# EAGLE design Corsa LCD (EAGLE 9.5.1)
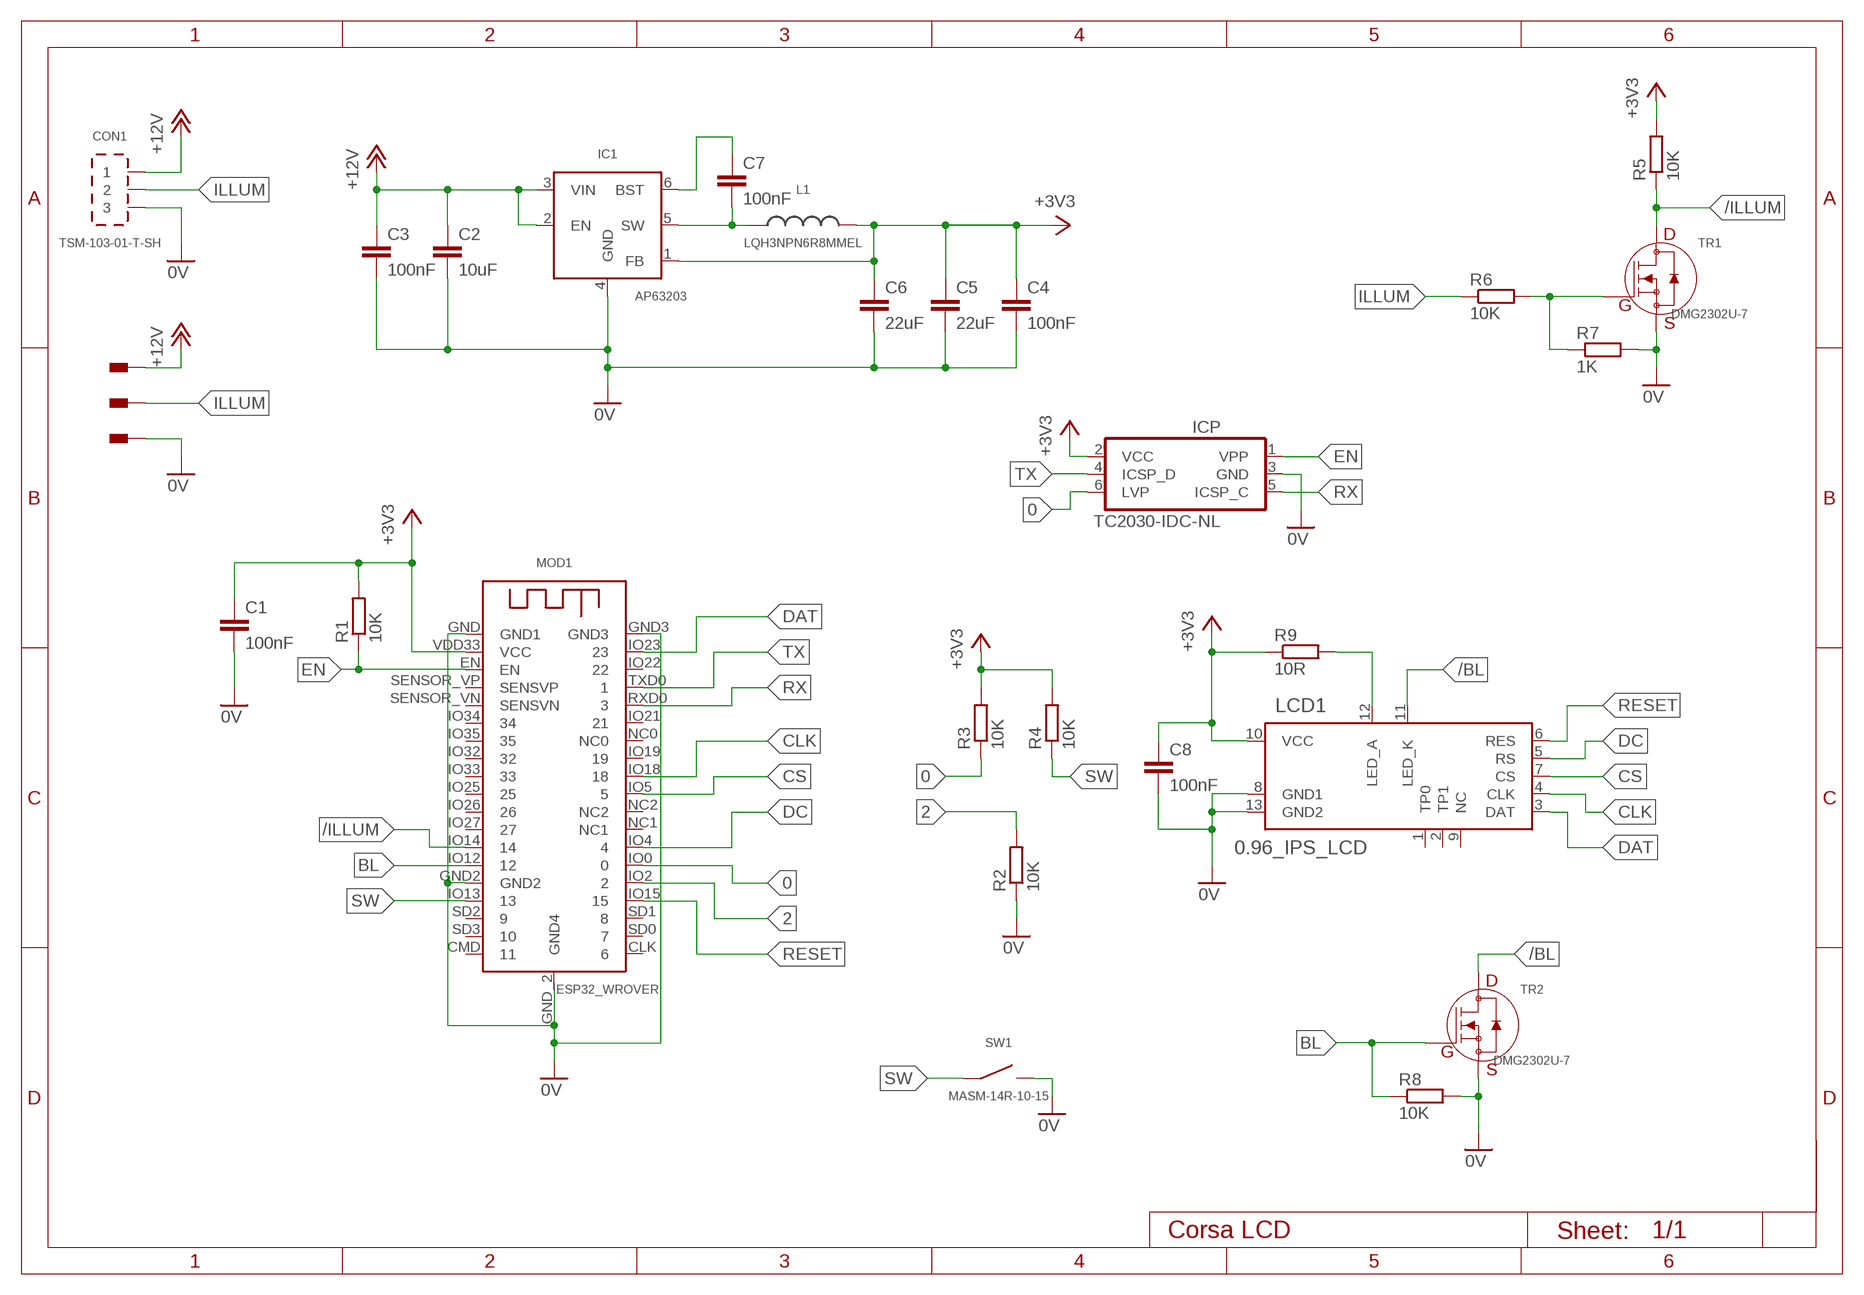
[diagram p0: schematic, sheet 1]

## Parts
C1  100nF  C-EUC0603  [C0603]
C2  10uF  C-EUC0603  [C0603]
C3  100nF  C-EUC0603  [C0603]
C4  100nF  C-EUC0603  [C0603]
C5  22uF  C-EUC0603  [C0603]
C6  22uF  C-EUC0603  [C0603]
C7  100nF  C-EUC0603  [C0603]
C8  100nF  C-EUC0603  [C0603]
CON1  TSM-103-01-T-SH  [TSM-103-01-T-SH]
IC1  AP63203  [TSOT26]
ICP  TC2030-IDC-NL  [TC2030-IDC-NL]
L1  LQH3NPN6R8MMEL  [LQH3NPN]
LCD1  0.96_IPS_LCD  [0.96_IPS_LCD]
MOD1  ESP32_WROVER  ESP32_WROOVER  [ESP32_WROOVER]
PIN1  SOLDERPAD  [SOLDERPAD]
PIN2  SOLDERPAD  [SOLDERPAD]
PIN3  SOLDERPAD  [SOLDERPAD]
R1  10K  R-EU_R0603  [R0603]
R2  10K  R-EU_R0603  [R0603]
R3  10K  R-EU_R0603  [R0603]
R4  10K  R-EU_R0603  [R0603]
R5  10K  R-EU_R0603  [R0603]
R6  10K  R-EU_R0603  [R0603]
R7  1K  R-EU_R0603  [R0603]
R8  10K  R-EU_R0603  [R0603]
R9  10R  R-EU_R0603  [R0603]
SW1  MASM-14R-10-15  [MASM-14]
TR1  DMG2302U-7  [SOT23]
TR2  DMG2302U-7  [SOT23]

## Nets
0: ICP.6(LVP) MOD1.IO0 R3.1
0V: C1.2 C2.2 C3.2 C4.2 C5.2 C6.2 C8.2 CON1.3 IC1.4(GND) ICP.3(GND) LCD1.8(GND1) LCD1.13(GND2) MOD1.GND2 MOD1.GND3 MOD1.GND(GND1) MOD1.GND_2(GND4) PIN3.1 R2.1 R7.2 R8.2 SW1.2 TR1.2(S) TR2.2(S)
2: MOD1.IO2 R2.2
+3V3: C1.1 C4.1 C5.1 C6.1 C8.1 IC1.1(FB) ICP.2(VCC) L1.2 LCD1.10(VCC) MOD1.VDD33(VCC) R1.2 R3.2 R4.2 R5.2 R9.1
+12V: C2.1 C3.1 CON1.1 IC1.2(EN) IC1.3(VIN) PIN1.1
/BL: LCD1.11(LED_K) TR2.3(D)
/ILLUM: MOD1.IO14 R5.1 TR1.3(D)
BL: MOD1.IO12 R8.1 TR2.1(G)
CLK: LCD1.4(CLK) MOD1.IO18
CS: LCD1.7(CS) MOD1.IO5
DAT: LCD1.3(DAT) MOD1.IO23
DC: LCD1.5(RS) MOD1.IO4
EN: ICP.1(VPP) MOD1.EN R1.1
ILLUM: CON1.2 PIN2.1 R6.1
N$1: LCD1.12(LED_A) R9.2
N$2: R6.2 R7.1 TR1.1(G)
N$3: C7.1 IC1.6(BST)
N$5: C7.2 IC1.5(SW) L1.1
RESET: LCD1.6(RES) MOD1.IO15
RX: ICP.5(ICSP_C) MOD1.RXD0
SW: MOD1.IO13 R4.1 SW1.1
TX: ICP.4(ICSP_D) MOD1.TXD0
Unconnected: LCD1.1(TP0) LCD1.2(TP1) LCD1.9(NC) MOD1.CLK MOD1.CMD MOD1.IO19 MOD1.IO21 MOD1.IO22 MOD1.IO25 MOD1.IO26 MOD1.IO27 MOD1.IO32 MOD1.IO33 MOD1.IO34 MOD1.IO35 MOD1.NC0 MOD1.NC1 MOD1.NC2 MOD1.SD0 MOD1.SD1 MOD1.SD2 MOD1.SD3 MOD1.SENSOR_VN(SENSVN) MOD1.SENSOR_VP(SENSVP)

## Library data of the parts
C1-C8 = resistor:C-EU: CAPACITOR, European symbol
CON1 = 0.96_LCD:TSM-103-01-T-SH
IC1 = 0.96_LCD:AP63203
ICP = TagConnect:TC2030-IDC: Tag-Connect In Circuit Programming & Debug Cable 6 Pin http://www.tag-connect.com
L1 = 0.96_LCD:LQH3NPN6R8MMEL
LCD1 = 0.96_LCD:0.96_IPS_LCD
MOD1 = 0.96_LCD:ESP32_WROOVER
PIN1-PIN3 = 0.96_LCD:SOLDERPAD
R1-R9 = resistor:R-EU_: RESISTOR, European symbol
SW1 = 0.96_LCD:MASM-14R-10-15
TR1 TR2 = Carls2:DMG2302U-7

## Board
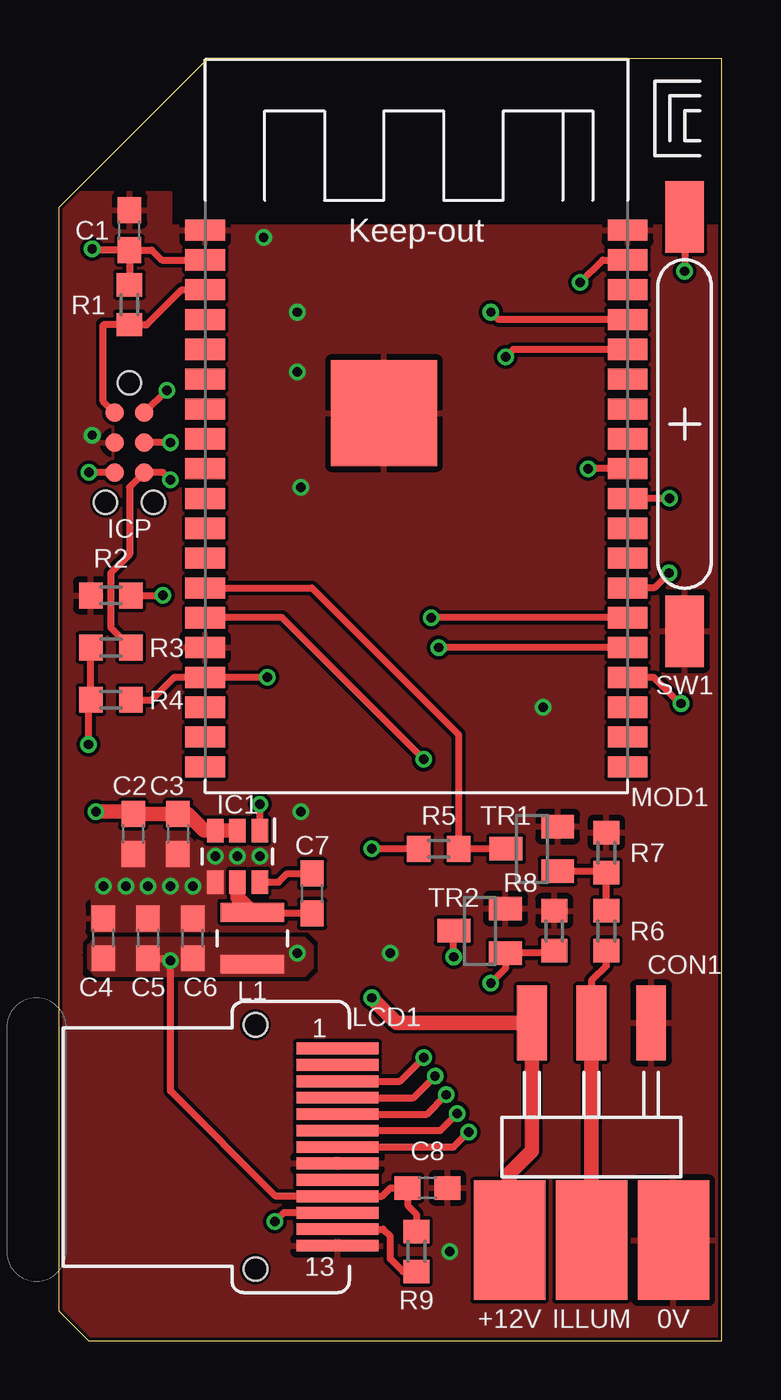
[diagram p1: board, top side]
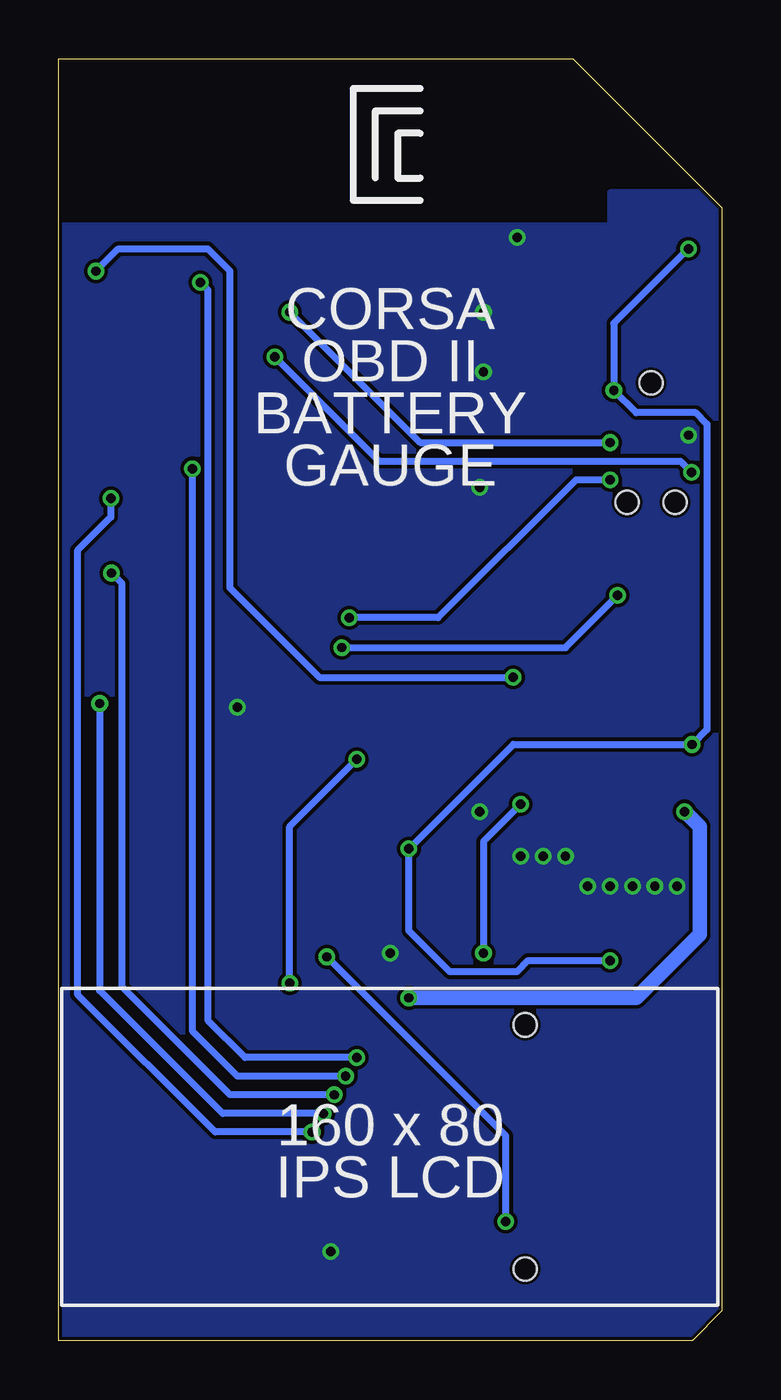
[diagram p2: board, bottom side, seen from below]

Size 28.26 x 54.61 mm. Coordinates in mm from the lower left corner, seen from the top.
Outline: 0,48.26 0,1.27 1.27,0 28.26,0 28.26,54.61 6.35,54.61 0,48.26
Copper layers (1*16): Top 0.035mm / dielectric 1.5mm / Bottom 0.035mm
Design rules "OSH_Default *": minimum track width 6mil, minimum drill 0.3mm, track to track 6mil, track to pad 6mil, pad to pad 6mil, via to via 6mil, smd to smd 6mil, copper to edge 6mil, drill to drill 6mil, minimum pad ring 6mil, minimum via ring 6mil, stop-mask expansion 4mil, vias tented up to drill 0.4mm, thermal gap 10mil

### Footprints (pad centres in the part's own frame; a part is rotated, then mirrored left to right if it is on the bottom)
C0603 = smd 1.1 x 1: 1 -0.85,0; 2 0.85,0
TSM-103-01-T-SH = smd 1.27 x 3.18: 1 2.54,-5.283; 2 0,-5.283; 3 -2.54,-5.283
TSOT26 = smd 0.7 x 1: 1 -0.95,-1.1; 2 0,-1.1; 3 0.95,-1.1; 4 0.95,1.1; 5 0,1.1; 6 -0.95,1.1
TC2030-IDC-NL = smd 0.787 x 0.787: 1 -1.27,-0.635; 2 -1.27,0.635; 3 0,-0.635; 4 0,0.635; 5 1.27,-0.635; 6 1.27,0.635 | hole 0.991: -2.54,0; 2.54,1.016; 2.54,-1.016
LQH3NPN = smd 0.8 x 2.7: 1 -1.1,0; 2 1.1,0
0.96_IPS_LCD = smd 3.5 x 0.5: 1 -0.5,4.2; 2 -0.5,3.5; 3 -0.5,2.8; 4 -0.5,2.1; 5 -0.5,1.4; 6 -0.5,0.7; 7 -0.5,0; 8 -0.5,-0.7; 9 -0.5,-1.4; 10 -0.5,-2.1; 11 -0.5,-2.8; 12 -0.5,-3.5; 13 -0.5,-4.2 | hole 1: -4,5.2; -4,-5.2
ESP32_WROOVER = smd 1.7 x 0.9: CLK 9,-11.43; CMD -9,-11.43; EN -9,8.89; GND -9,11.43; GND3 9,11.43; GND_2 -9,-6.35; IO0 9,-5.08; IO2 9,-6.35; IO4 9,-3.81; IO5 9,0; IO12 -9,-5.08; IO13 -9,-7.62; IO14 -9,-3.81; IO15 9,-7.62; IO18 9,1.27; IO19 9,2.54; IO21 9,5.08; IO22 9,8.89; IO23 9,10.16; IO25 -9,0; IO26 -9,-1.27; IO27 -9,-2.54; IO32 -9,2.54; IO33 -9,1.27; IO34 -9,5.08; IO35 -9,3.81; NC0 9,3.81; NC1 9,-2.54; NC2 9,-1.27; RXD0 9,6.35; SD0 9,-10.16; SD1 9,-8.89; SD2 -9,-8.89; SD3 -9,-10.16; SENSOR_VN -9,6.35; SENSOR_VP -9,7.62; TXD0 9,7.62; VDD33 -9,10.16 | smd 4.5 x 4.5: GND2 -1.38,3.64
SOLDERPAD = smd 3.048 x 5.08: 1 0,0
R0603 = smd 1 x 1.1: 1 -0.85,0; 2 0.85,0
MASM-14 = smd 3.05 x 1.65: 1 -8.825,0; 2 8.825,0
SOT23 = smd 1 x 1.4: 1 -0.95,-1.1; 2 0.95,-1.1; 3 0,1.1

### Placement (x,y rotation side)
C1  3.02,47.31 90 top
C2  3.17,21.59 270 top
C3  5.08,21.59 270 top
C4  1.91,17.14 90 top
C5  3.81,17.14 90 top
C6  5.71,17.14 90 top
C7  10.79,19.05 270 top
C8  15.72,6.51 0 top
CON1  22.7,8.26 180 top
IC1  7.62,20.64 180 top
ICP  3.02,38.26 270 top
L1  8.26,17.14 270 top
LCD1  12.38,8.26 0 top
MOD1  15.24,35.88 0 top
PIN1  19.21,4.29 0 top
PIN2  22.7,4.29 0 top
PIN3  26.19,4.29 0 top
R1  3.02,44.13 90 top
R2  2.22,31.75 0 top
R3  2.22,29.53 180 top
R4  2.22,27.3 180 top
R5  16.19,20.95 180 top
R6  23.34,17.46 90 top
R7  23.34,20.8 90 top
R8  21.11,17.46 90 top
R9  15.24,3.81 270 top
SW1  26.67,39.05 270 top
TR1  20.16,20.95 90 top
TR2  17.94,17.46 90 top

### Tracks (layer width: path | path; a pad name or v marks a point on that pad's centre or on a via)
0  (via drill 0.4)
  Top 0.305: MOD1.IO0 v15.88,30.8 | R3.1 2.22,30.38 2.22,32.7 3.02,33.5 3.02,36.35 ICP.6 4.45,36.99 v4.76,36.67
  Bottom 0.305: v4.76,36.67 6.21,36.67 12.09,30.8 v15.88,30.8
0V  (via drill 0.4)
  other vias: 6.67,20.64 7.62,20.64 8.57,20.64 5.71,19.37 4.76,19.37 3.81,19.37 2.86,19.37 1.91,19.37 10.32,22.54 14.13,16.51 20.64,26.99 10.32,36.35 10.16,41.27 10.16,43.81 8.73,46.99 1.43,38.58 16.67,3.81
  pour Top: 0,48.9 4.76,48.9 4.76,47.47 28.26,47.47 28.26,0 0,0 0,16.35 0.95,16.35 0.95,15.56 1.27,15.24 10.64,15.24 11.11,15.72 11.11,16.99 10.64,17.46 1.43,17.46 0.95,16.99 0.95,16.51 0,16.51
  pour Bottom: 0,48.9 4.76,48.9 4.76,47.47 28.26,47.47 28.26,0 0,0
  pour Top (no thermals): 1.43,17.46 6.35,17.46 6.67,17.78 6.67,18.89 7.14,18.89 7.14,20.16 9.21,20.16 9.21,21.11 5.87,21.11 5.4,21.59 1.43,21.59
2  (via drill 0.4)
  Top 0.305: MOD1.IO2 v16.19,29.53 | R2.2 v4.45,31.75
  Bottom 0.305: v16.19,29.53 6.67,29.53 v4.45,31.75
+3V3  (via drill 0.4)
  Top 0.305: IC1.1 v8.57,22.86 | C5.1 4.66,16.3 v4.76,16.19 4.76,10.64 9.24,6.16 LCD1.10 13.78,6.16 14.13,6.51 C8.1 14.87,5.77 15.24,5.4 R9.1 | v1.27,25.4 1.27,27.2 R4.2 R3.2 | R5.2 v13.34,20.95 | v4.6,40.48 ICP.2 | MOD1.VDD33 4.39,46.04 3.97,46.46 C1.1 | C1.1 R1.2 | C1.1 1.49,46.46 v1.43,46.51
  Bottom 0.305: v8.57,22.86 10.16,21.27 v10.16,16.51 | v4.76,16.19 8.26,16.19 8.73,15.72 11.59,15.72 13.34,17.46 v13.34,20.95 8.89,25.4 v1.27,25.4 0.64,26.04 0.64,39.05 1.11,39.53 ICP.2 v4.6,40.48 4.6,43.34 v1.43,46.51
  pour Top (no thermals): 1.59,17.14 1.27,16.83 1.27,15.88 1.59,15.56 10.48,15.56 10.79,15.88 10.79,16.83 10.48,17.14
+12V  (via drill 0.4)
  Top 0.61: v1.59,22.54 3.07,22.54 C2.1 C3.1 5.5,22.44 6.2,21.74 IC1.3 IC1.2 | v13.34,14.61 14.4,13.54 CON1.1 20.16,8.1 19.21,7.14 PIN1.1
  Bottom 0.61: v13.34,14.61 3.65,14.61 0.95,17.3 0.95,21.91 v1.59,22.54
/BL  (via drill 0.4)
  Top 0.305: LCD1.11 9.58,5.46 v9.21,5.08 | v16.83,16.35 16.83,17.45 TR2.3
  Bottom 0.305: v9.21,5.08 9.21,8.73 v16.83,16.35
/ILLUM
  Top 0.305: MOD1.IO14 10.79,32.07 17.04,25.82 R5.1 TR1.3
BL  (via drill 0.4)
  Top 0.305: MOD1.IO12 9.53,30.8 v15.56,24.77 | R8.1 21.01,16.51 TR2.1 19.04,15.86 v18.41,15.24
  Bottom 0.305: v18.41,15.24 18.41,21.91 v15.56,24.77
CLK  (via drill 0.4)
  Top 0.305: LCD1.4 15.12,10.36 v16.03,11.27 | MOD1.IO18 v22.57,37.15
  Bottom 0.305: v16.03,11.27 20.64,11.27 22.54,13.18 22.54,37.15 v22.57,37.15
CS  (via drill 0.4)
  Top 0.305: LCD1.7 16.83,8.26 v17.46,8.89 | v26.04,35.88 MOD1.IO5
  Bottom 0.305: v17.46,8.89 21.59,8.89 27.46,14.76 27.46,33.66 26.04,35.08 v26.04,35.88
DAT  (via drill 0.4)
  Top 0.305: LCD1.3 14.55,11.05 v15.56,12.06 | v22.23,45.09 23.18,46.04 MOD1.IO23
  Bottom 0.305: v15.56,12.06 20.32,12.06 21.91,13.65 21.91,44.77 v22.23,45.09
DC  (via drill 0.4)
  Top 0.305: LCD1.5 15.69,9.65 v16.51,10.48 | v26.01,32.7 25.38,32.07 MOD1.IO4
  Bottom 0.305: v16.51,10.48 20.95,10.48 25.56,15.08 25.56,32.25 v26.01,32.7
EN
  Top 0.305: ICP.1 1.91,40.01 1.91,43.28 R1.1 3.75,43.28 5.24,44.77 MOD1.EN
ILLUM
  Top 0.305: R6.1 23.34,15.98 22.7,15.34 CON1.2
  Top 0.61: CON1.2 PIN2.1
N$1
  Top 0.305: LCD1.12 13.82,4.75 14.13,4.45 14.13,3.49 14.66,2.96 R9.2
N$2
  Top 0.305: TR1.1 23.28,20 R7.1 R6.2
N$3
  Top 0.305: IC1.6 9.38,19.54 9.74,19.9 C7.1
N$5
  Top 0.305: C7.2 8.3,18.2 L1.1
  Top 0.61: 8.3,18.2 7.62,18.88 IC1.5
RESET  (via drill 0.4)
  Top 0.305: LCD1.6 16.26,8.96 v16.99,9.68 | v26.51,27.15 26.46,27.15 25.35,28.26 MOD1.IO15
  Bottom 0.305: v16.99,9.68 21.27,9.68 26.51,14.92 v26.51,27.15
RX  (via drill 0.4)
  Top 0.305: MOD1.RXD0 19.37,42.23 v19.05,41.91 | ICP.5 v1.29,36.99 1.27,36.99
  Bottom 0.305: v19.05,41.91 14.61,37.47 1.77,37.47 v1.29,36.99
SW  (via drill 0.4)
  Top 0.305: 3.17,27.2 R4.1 3.97,27.3 4.92,28.26 MOD1.IO13 v8.89,28.26 | SW1.1 v26.67,45.56
  Bottom 0.305: v8.89,28.26 17.14,28.26 20.95,32.07 20.95,45.56 21.91,46.51 25.72,46.51 v26.67,45.56
TX  (via drill 0.4)
  Top 0.305: MOD1.TXD0 18.73,43.5 v18.41,43.81 | v4.76,38.26 ICP.4
  Bottom 0.305: v18.41,43.81 12.86,38.26 v4.76,38.26

### Text on the board
tPlace: +12V | ILLUM | 0V
bPlace: CORSA | OBD II | BATTERY | GAUGE | 160 x 80 | IPS LCD